# Altium schematic sheet decoupling.SchDoc
size A4; DocumentNumber: 2; SheetNumber: 2; SheetTotal: 6
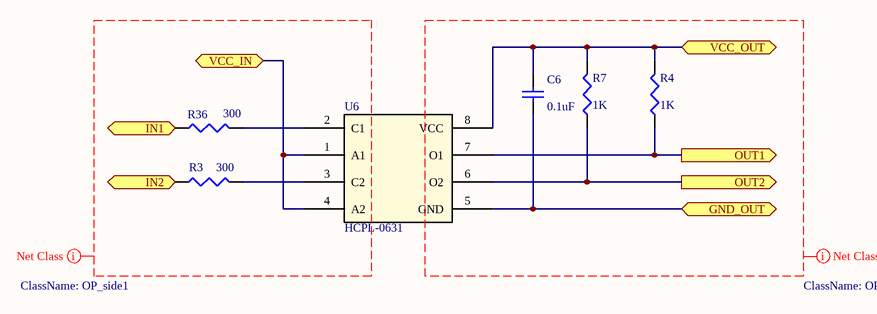
[diagram p0: decoupling.SchDoc]

## Parts
C6  value 0.1uF  [C_0603]  (hidden comment: Cap)
R3  value 300  [R_0603]  (hidden comment: Res)
R4  value 1K  [R_0603]  (hidden comment: Res)
R7  value 1K  [R_0603]  (hidden comment: Res)
R36  value 300  [R_0603]  (hidden comment: Res)
U6  HCPL-0631  [SO8_M]

## Ports
GND_OUT, IN1 (in), IN2 (in), OUT1 (out), OUT2 (out), VCC_IN, VCC_OUT

## Nets
GND_OUT: C6.1 U6.5(GND) ; port GND_OUT
IN1: R36.1 ; port IN1
IN2: R3.1 ; port IN2
OUT1: R4.1 U6.7(O1) ; port OUT1
OUT2: R7.1 U6.6(O2) ; port OUT2
VCC_IN: U6.1(A1) U6.4(A2) ; port VCC_IN
VCC_OUT: C6.2 R4.2 R7.2 U6.8(VCC) ; port VCC_OUT
NetR3_2: R3.2 U6.3(C2)
NetR36_2: R36.2 U6.2(C1)

## Layout directives
net class OP_side1: (no net found under the mark)
net class OP_side2: (no net found under the mark)

## Library data of the parts
C6 = Cap Semi: Capacitor; Published: 8-Jun-2000; LatestRevisionDate: 29-May-2009; LatestRevisionNote: IPC-7351 Footprint Added.; PackageReference: C1206; Publisher: Altium Limited; PackageDescription: Chip Capacitor
R3 R4 R7 R36 = Res3: Resistor; Published: 8-Jun-2000; LatestRevisionDate: 29-May-2009; LatestRevisionNote: IPC-7351 Footprint Added.; PackageReference: J1-0603; Publisher: Altium Limited; PackageDescription: Chip Resistor
U6 = HCPL-0631: Optocoupler, dual